# EAGLE design tent1 (EAGLE 9.0.1)
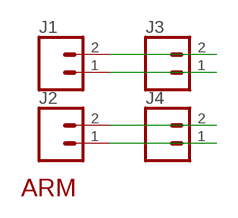
[diagram p0: schematic, sheet 1]

## Parts
J1  CONN_02LOCK  [1X02_LOCK]
J2  CONN_02LOCK  [1X02_LOCK]
J3  CONN_02LOCK  [1X02_LOCK]
J4  CONN_02LOCK  [1X02_LOCK]
U$1  ARMTENT1  [TENT1]

## Nets
V1: J1.1 J3.1
V2: J1.2 J3.2
V3: J2.1 J4.1
V4: J2.2 J4.2

## Library data of the parts
J1-J4 = SparkFun-Connectors:CONN_02: Multi connection point. Often used as Generic Header-pin footprint for 0.1 inch spaced/style header connections On any of the 0.1 inch spaced packages, you can populate with these: Break Away Headers - Straight <https://www.sparkfun.com/products/116> (PRT-00116) Break Away Male Headers - Right Angle <https://www.sparkfun.com/products/553> (PRT-00553) Female Headers <https://www.sparkfun.com/products/115> (PRT-00115) Break Away Headers - Machine Pin <https://www.sparkfun.com/products/117> (PRT-00117) Break Away Female Headers - Swiss Machine Pin <https://www.sparkfun.com/products/743> (PRT-00743) For SCREWTERMINALS and SPRING TERMINALS visit here: Screw Terimnals on SparkFun.com <https://www.sparkfun.com/search/results?term=Screw+Terminals> (5mm/3.5mm/2.54mm spacing) This device is also useful as a general connection point to wire up your design to another part of your project. Our various solder wires solder well into these plated through hole pads. Hook-Up Wire - Assortment (Stranded, 22 AWG) <https://www.sparkfun.com/products/11375> (PRT-11375) Hook-Up Wire - Assortment (Solid Core, 22 AWG) <https://www.sparkfun.com/products/11367> (PRT-11367) View the entire wire category on our website here <https://www.sparkfun.com/categories/141> Special notes: Molex polarized connector foot print use with: PRT-08233 with associated crimp pins and housings. 2.54_SCREWTERM for use with PRT-10571. 3.5mm Screw Terminal footprints for PRT-08084 5mm Screw Terminal footprints for use with PRT-08432
U$1 = arms:ARM

## Board
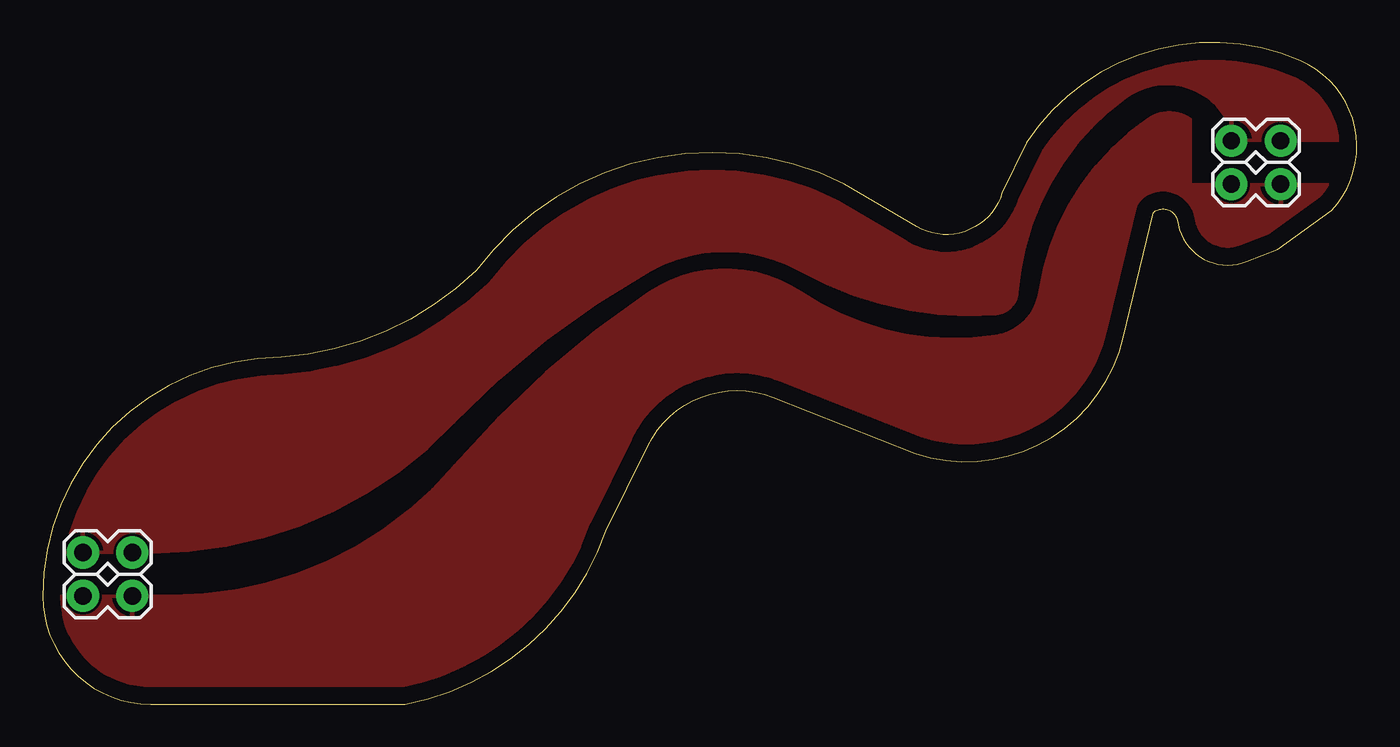
[diagram p1: board, top side]
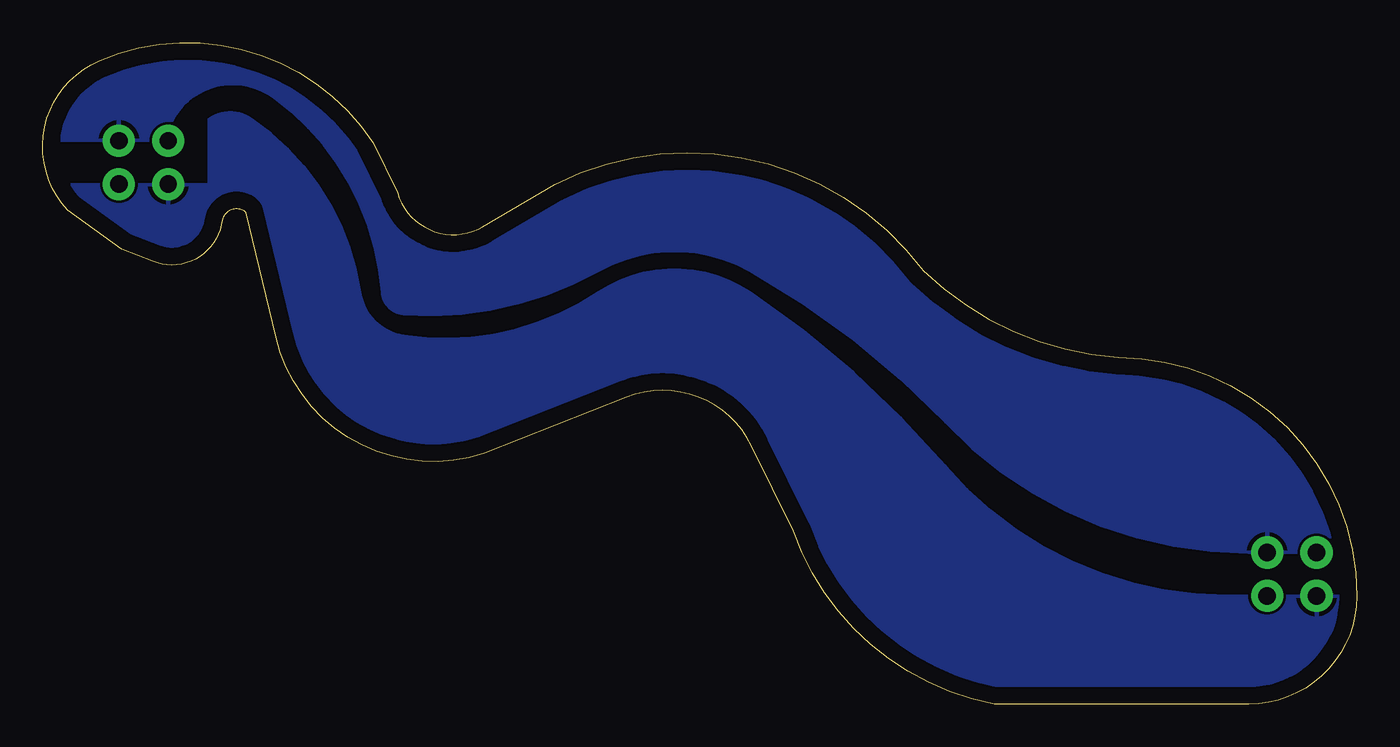
[diagram p2: board, bottom side, seen from below]

Size 77.03 x 38.76 mm. Coordinates in mm from the lower left corner, seen from the top.
Outline: 0,6.34 arc90 6.34,0 21.26,0 arc60 33.02,10.16 35.49,15.16 arc-85 42.81,17.98 51.14,14.7 arc95 63.36,21.5 65.1,28.8 arc-112 66.48,28.46 66.56,28.09 arc100 70.59,25.95 72.39,26.67 75.56,28.96 arc110 73.71,37.71 arc80 57.66,32.89 56.24,29.96 arc-104 51.23,27.99 46.99,30.48 arc80 25.4,25.4 arc-40 13.97,20.32 arc90 0,6.34
Copper layers (1*16): Top 0.035mm / dielectric 1.5mm / Bottom 0.035mm
Design rules "default": minimum track width 6mil, minimum drill 0.35mm, track to track 6mil, track to pad 6mil, pad to pad 6mil, via to via 6mil, smd to smd 6mil, copper to edge 40mil, drill to drill 6mil, minimum pad ring 10mil, minimum via ring 8mil, stop-mask expansion 4mil, vias tented up to drill 0mil, thermal gap 10mil

### Footprints (pad centres in the part's own frame; a part is rotated, then mirrored left to right if it is on the bottom)
1X02_LOCK = drill 1.016 pad 1.88: 1 -0.178,0; 2 2.718,0

### Placement (x,y rotation side)
J1  69.85,33.02 0 top
J2  69.85,30.48 0 top
J3  2.54,8.89 0 top
J4  2.54,6.35 0 top
U$1  12.7,1.27 0 top

### Tracks (layer width: path | path; a pad name or v marks a point on that pad's centre or on a via)
V1
  pour Top: 0,8.89 6.35,8.89 arc46 24.13,16.51 arc-17 35.56,25.4 arc-59 44.45,25.4 arc34 55.88,22.86 arc81 57.15,24.13 arc-50 63.5,35.56 arc-116 69.85,33.02 77.47,33.02 77.47,40.64 0,40.64 0,35.56
V2
  pour Bottom: 0,8.89 6.35,8.89 arc46 24.13,16.51 arc-17 35.56,25.4 arc-59 44.45,25.4 arc34 55.88,22.86 arc81 57.15,24.13 arc-50 63.5,35.56 arc-116 69.85,33.02 77.47,33.02 77.47,40.64 0,40.64 0,35.56
V3
  pour Bottom: 0,0 0,6.35 7.62,6.35 arc50 24.13,13.97 arc-16 35.56,24.13 arc-67 44.45,24.13 arc42 55.88,21.59 arc73 58.42,24.13 arc-47 64.77,34.29 arc-69 67.31,34.29 67.31,30.48 77.47,30.48 77.47,0
V4
  pour Top: 0,0 0,6.35 7.62,6.35 arc50 24.13,13.97 arc-16 35.56,24.13 arc-67 44.45,24.13 arc42 55.88,21.59 arc73 58.42,24.13 arc-47 64.77,34.29 arc-69 67.31,34.29 67.31,30.48 77.47,30.48 77.47,0

### Text on the board
tStop: by / @securelyfitz / git.io/sao-arms